# Altium schematic sheet ADC.SchDoc
size A4; Author: Thomas Kreppel; CompanyName: Universidad de Santiago de Chile; Address1: Avenida Ecuador Nº 3519; Address2: Estación Central, Santiago; Address3: Chile; DocumentNumber: 6; SheetNumber: 6; SheetTotal: 10
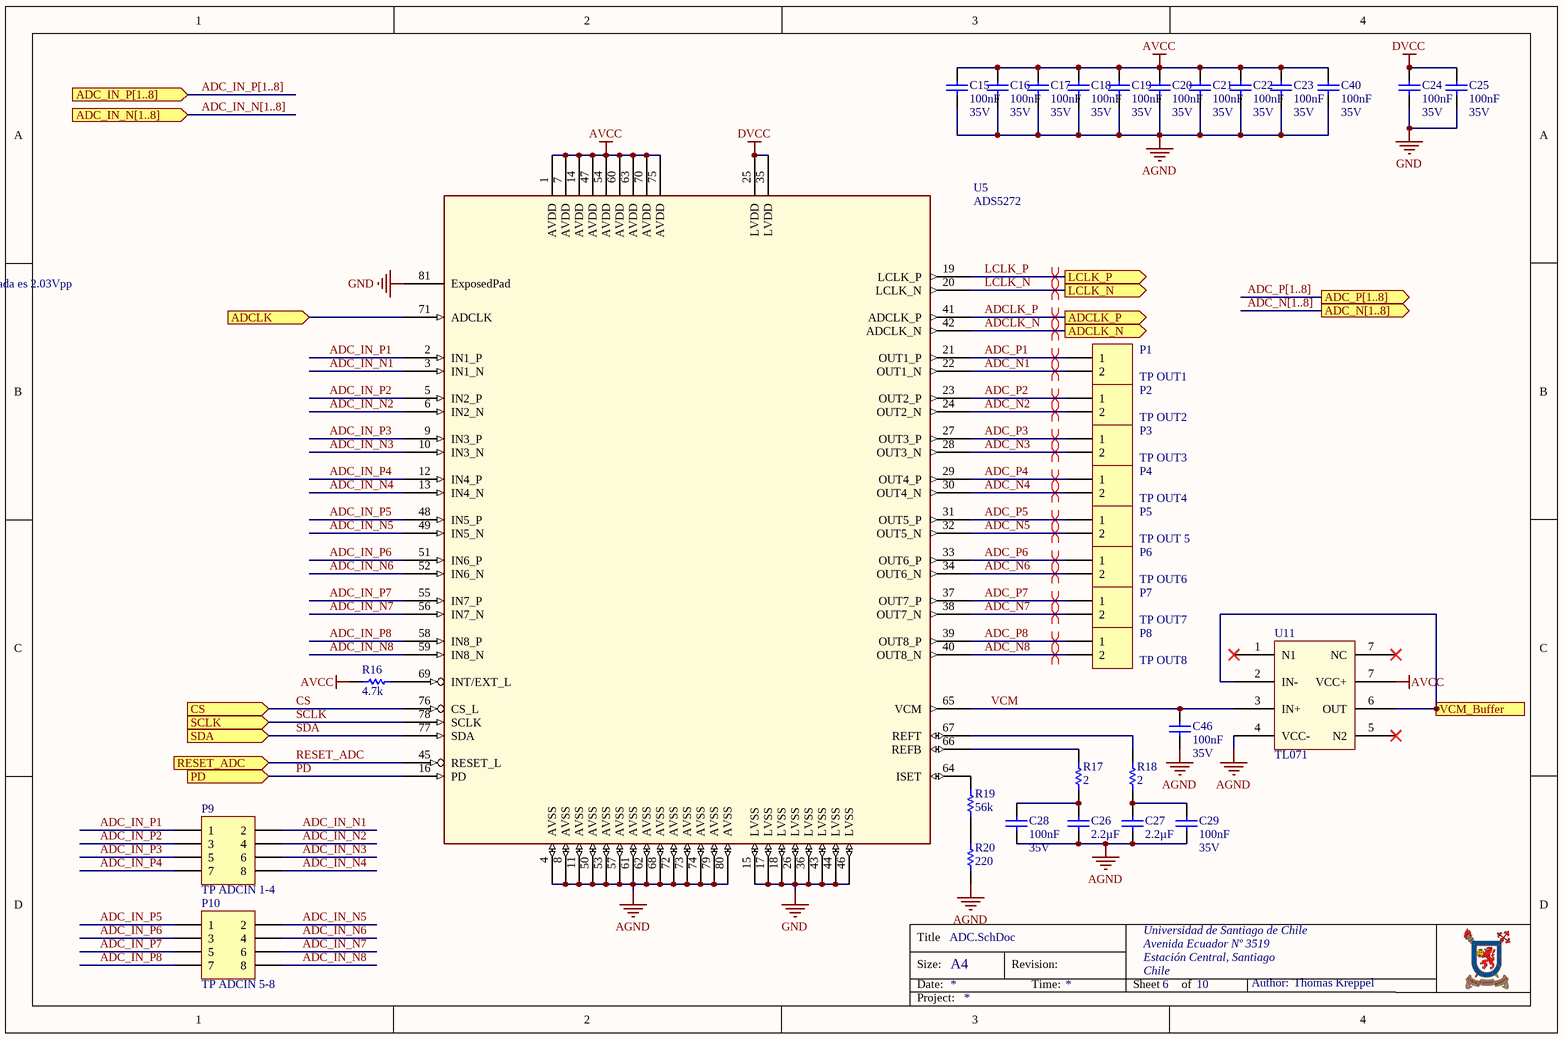
[diagram p0: ADC.SchDoc]

## Parts
C15  100nF  Voltage: 35V  [CAP_0603]
C16  100nF  Voltage: 35V  [CAP_0603]
C17  100nF  Voltage: 35V  [CAP_0603]
C18  100nF  Voltage: 35V  [CAP_0603]
C19  100nF  Voltage: 35V  [CAP_0603]
C20  100nF  Voltage: 35V  [CAP_0603]
C21  100nF  Voltage: 35V  [CAP_0603]
C22  100nF  Voltage: 35V  [CAP_0603]
C23  100nF  Voltage: 35V  [CAP_0603]
C24  100nF  Voltage: 35V  [CAP_0603]
C25  100nF  Voltage: 35V  [CAP_0603]
C26  2.2µF  [CAP_0603]
C27  2.2µF  [CAP_0603]
C28  100nF  Voltage: 35V  [CAP_0603]
C29  100nF  Voltage: 35V  [CAP_0603]
C40  100nF  Voltage: 35V  [CAP_0603]
C46  100nF  Voltage: 35V  [CAP_0603]
P1  TP OUT1  [HDR1X2]  (no BOM)
P2  TP OUT2  [HDR1X2]  (no BOM)
P3  TP OUT3  [HDR1X2]  (no BOM)
P4  TP OUT4  [HDR1X2]  (no BOM)
P5  TP OUT 5  [HDR1X2]  (no BOM)
P6  TP OUT6  [HDR1X2]  (no BOM)
P7  TP OUT7  [HDR1X2]  (no BOM)
P8  TP OUT8  [HDR1X2]  (no BOM)
P9  TP ADCIN 1-4  [HDR2X4]  (no BOM)
P10  TP ADCIN 5-8  [HDR2X4]  (no BOM)
R16  4.7k  [RES_0603]
R17  2  [RES_0603]
R18  2  [RES_0603]
R19  56k  [RES_0603]
R20  220  [RES_0603]
U5  ADS5272  [TSQFP50P1400X1400_HS-80M]
U11  TL071  [SOIC8_N]

## Ports
ADC_IN_N[1..8] (in), ADC_IN_P[1..8] (in), ADC_N[1..8] (out), ADC_P[1..8] (out), ADCLK (in), ADCLK_N (out), ADCLK_P (out), CS (in), LCLK_N (out), LCLK_P (out), PD (in), RESET_ADC (in), SCLK (in), SDA (in), VCM_Buffer (out)

## Nets
AGND: C15.2 C16.2 C17.2 C18.2 C19.2 C20.2 C21.2 C22.2 C23.2 C26.2 C27.2 C28.2 C29.2 C40.2 C46.2 R20.1 U5.4(AVSS) U5.8(AVSS) U5.11(AVSS) U5.50(AVSS) U5.53(AVSS) U5.57(AVSS) U5.61(AVSS) U5.62(AVSS) U5.68(AVSS) U5.72(AVSS) U5.73(AVSS) U5.74(AVSS) U5.79(AVSS) U5.80(AVSS) U11.4(VCC-)
AVCC: C15.1 C16.1 C17.1 C18.1 C19.1 C20.1 C21.1 C22.1 C23.1 C40.1 R16.2 U5.1(AVDD) U5.7(AVDD) U5.14(AVDD) U5.47(AVDD) U5.54(AVDD) U5.60(AVDD) U5.63(AVDD) U5.70(AVDD) U5.75(AVDD) U11.7(VCC+)
DVCC: C24.1 C25.1 U5.25(LVDD) U5.35(LVDD)
GND: C24.2 C25.2 U5.15(LVSS) U5.17(LVSS) U5.18(LVSS) U5.26(LVSS) U5.36(LVSS) U5.43(LVSS) U5.44(LVSS) U5.46(LVSS) U5.81(ExposedPad)
ADC_IN_N1: P9.2 U5.3(IN1_N)
ADC_IN_N2: P9.4 U5.6(IN2_N)
ADC_IN_N3: P9.6 U5.10(IN3_N)
ADC_IN_N4: P9.8 U5.13(IN4_N)
ADC_IN_N5: P10.2 U5.49(IN5_N)
ADC_IN_N6: P10.4 U5.52(IN6_N)
ADC_IN_N7: P10.6 U5.56(IN7_N)
ADC_IN_N8: P10.8 U5.59(IN8_N)
ADC_IN_P1: P9.1 U5.2(IN1_P)
ADC_IN_P2: P9.3 U5.5(IN2_P)
ADC_IN_P3: P9.5 U5.9(IN3_P)
ADC_IN_P4: P9.7 U5.12(IN4_P)
ADC_IN_P5: P10.1 U5.48(IN5_P)
ADC_IN_P6: P10.3 U5.51(IN6_P)
ADC_IN_P7: P10.5 U5.55(IN7_P)
ADC_IN_P8: P10.7 U5.58(IN8_P)
ADC_N1: P1.2 U5.22(OUT1_N)
ADC_N2: P2.2 U5.24(OUT2_N)
ADC_N3: P3.2 U5.28(OUT3_N)
ADC_N4: P4.2 U5.30(OUT4_N)
ADC_N5: P5.2 U5.32(OUT5_N)
ADC_N6: P6.2 U5.34(OUT6_N)
ADC_N7: P7.2 U5.38(OUT7_N)
ADC_N8: P8.2 U5.40(OUT8_N)
ADC_P1: P1.1 U5.21(OUT1_P)
ADC_P2: P2.1 U5.23(OUT2_P)
ADC_P3: P3.1 U5.27(OUT3_P)
ADC_P4: P4.1 U5.29(OUT4_P)
ADC_P5: P5.1 U5.31(OUT5_P)
ADC_P6: P6.1 U5.33(OUT6_P)
ADC_P7: P7.1 U5.37(OUT7_P)
ADC_P8: P8.1 U5.39(OUT8_P)
ADCLK: U5.71(ADCLK) ; port ADCLK
ADCLK_N: U5.42(ADCLK_N) ; port ADCLK_N
ADCLK_P: U5.41(ADCLK_P) ; port ADCLK_P
CS: U5.76(CS_L) ; port CS
LCLK_N: U5.20(LCLK_N) ; port LCLK_N
LCLK_P: U5.19(LCLK_P) ; port LCLK_P
PD: U5.16(PD) ; port PD
RESET_ADC: U5.45(RESET_L) ; port RESET_ADC
SCLK: U5.78(SCLK) ; port SCLK
SDA: U5.77(SDA) ; port SDA
VCM: C46.1 U5.65(VCM) U11.3(IN+)
VCM_Buffer: U11.2(IN-) U11.6(OUT) ; port VCM_Buffer
NetC26_1: C26.1 C28.1 R17.1
NetC27_1: C27.1 C29.1 R18.1
NetR16_1: R16.1 U5.69(INT/EXT_L)
NetR17_2: R17.2 U5.66(REFB)
NetR18_2: R18.2 U5.67(REFT)
NetR19_1: R19.1 R20.2
NetR19_2: R19.2 U5.64(ISET)

Not connected (* = marked no-connect by the designer): U11 1(N1)* 5(N2)*

## Buses and harness runs
bus ADC_IN_N[1..8] = port ADC_IN_N[1..8]
bus ADC_IN_P[1..8] = port ADC_IN_P[1..8]
bus ADC_N[1..8] = port ADC_N[1..8]
bus ADC_P[1..8] = port ADC_P[1..8]

## Layout directives
differential pair: ADC_N1, ADC_N2, ADC_N3, ADC_N4, ADC_N5, ADC_N6, ADC_N7, ADC_N8, ADC_P1, ADC_P2, ADC_P3, ADC_P4, ADC_P5, ADC_P6, ADC_P7, ADC_P8, ADCLK_N, ADCLK_P, LCLK_N, LCLK_P

## Notes on the sheet
- Tension diferencial máxima en la entrada es 2.03Vpp
- Title
- Size:
- Date:
- A4
- Revision:
- Time:
- Sheet
- of
- Author:
- Project:

## Library data of the parts
C15-C25 C28 C29 C40 C46 = Cap_0603: Capacitor; MPN: C0603C104M5RACTU; Rule: PcbType=ProtelPcb; MF: KEMET; Dielectricum: X7R; Tolerance: 10%; Published: 8-Jun-2000; LatestRevisionDate: 17-Jul-2002; LatestRevisionNote: Re-released for DXP Platform.; PackageReference: RAD-0.3; Publisher: Altium Limited; Value: 100nF; Supplier 1: Digikey; Supplier 2: Mouser; Supplier Part Number 1: 399-7845-1-ND; Package: 0603
C26 C27 = Cap_0603: Capacitor; MPN: C0603C225K8RACTU; Rule: PcbType=ProtelPcb; MF: KEMET; Voltage: 10V; Dielectricum: X7R; Tolerance: 10%; Published: 8-Jun-2000; LatestRevisionDate: 17-Jul-2002; LatestRevisionNote: Re-released for DXP Platform.; PackageReference: RAD-0.3; Publisher: Altium Limited; Value: 2.2µF; Supplier 1: Digikey; Supplier 2: Mouser; Supplier Part Number 1: 399-11681-1-ND; Package: 0603
P1-P8 = Header 2: Header, 2-Pin; LatestRevisionDate: 17-Jul-2002; LatestRevisionNote: Re-released for DXP Platform.; Publisher: Altium Limited
P9 P10 = Header 4X2: Header, 4-Pin, Dual row; LatestRevisionDate: 17-Jul-2002; LatestRevisionNote: Re-released for DXP Platform.; Publisher: Altium Limited
R16 = Res0603: Manufacturer Part-Number: RC0603FR-074K7L; Tolerance: 1%; Published: 8-Jun-2000; LatestRevisionDate: 17-Jul-2002; LatestRevisionNote: Re-released for DXP Platform.; PackageReference: AXIAL-0.3; Publisher: Altium Limited; PackageDescription: Axial Device, Thru-Hole; 2 Leads; 0.3 in Pin Spacing; Value: 4.7k; Supplier 1: Digikey; Supplier 2: Mouser; Supplier Part Number 1: 311-4.70KHRCT-ND; Package: 0603
R17 R18 = Res0603: Manufacturer Part-Number: RC0603FR-072RL; Tolerance: 1%; Published: 8-Jun-2000; LatestRevisionDate: 17-Jul-2002; LatestRevisionNote: Re-released for DXP Platform.; PackageReference: AXIAL-0.3; Publisher: Altium Limited; PackageDescription: Axial Device, Thru-Hole; 2 Leads; 0.3 in Pin Spacing; Value: 2; Supplier 1: Digikey; Supplier 2: Mouser; Supplier Part Number 1: 311-2.00HRCT-ND; Package: 0603
R19 = Res0603: Manufacturer Part-Number: RT0603DRD0756KL; Tolerance: 1%; Published: 8-Jun-2000; LatestRevisionDate: 17-Jul-2002; LatestRevisionNote: Re-released for DXP Platform.; PackageReference: AXIAL-0.3; Publisher: Altium Limited; PackageDescription: Axial Device, Thru-Hole; 2 Leads; 0.3 in Pin Spacing; Value: 56k; Supplier 1: Digikey; Supplier 2: Mouser; Supplier Part Number 1: 311-56KDCT-ND; Package: 0603
R20 = Res0603: Manufacturer Part-Number: RC0603JR-07220RL; Tolerance: 1%; Published: 8-Jun-2000; LatestRevisionDate: 17-Jul-2002; LatestRevisionNote: Re-released for DXP Platform.; PackageReference: AXIAL-0.3; Publisher: Altium Limited; PackageDescription: Axial Device, Thru-Hole; 2 Leads; 0.3 in Pin Spacing; Value: 220; Supplier 1: Digikey; Supplier 2: Mouser; Supplier Part Number 1: 311-220GRCT-ND; Package: 0603
U5 = ADS5272: Manufacturer Part-Number: ADS5272IPFP; Supplier 1: Digikey; Supplier 2: Mouser; Supplier Part Number 1: 296-18605-ND
U11 = TL071: IC OPAMP JFET 3MHZ 8SOIC; Manufacturer Part-Number: TL071CDR; Supplier 1: Digikey; Supplier 2: Mouser; Supplier Part Number 1: 296-14994-1-ND